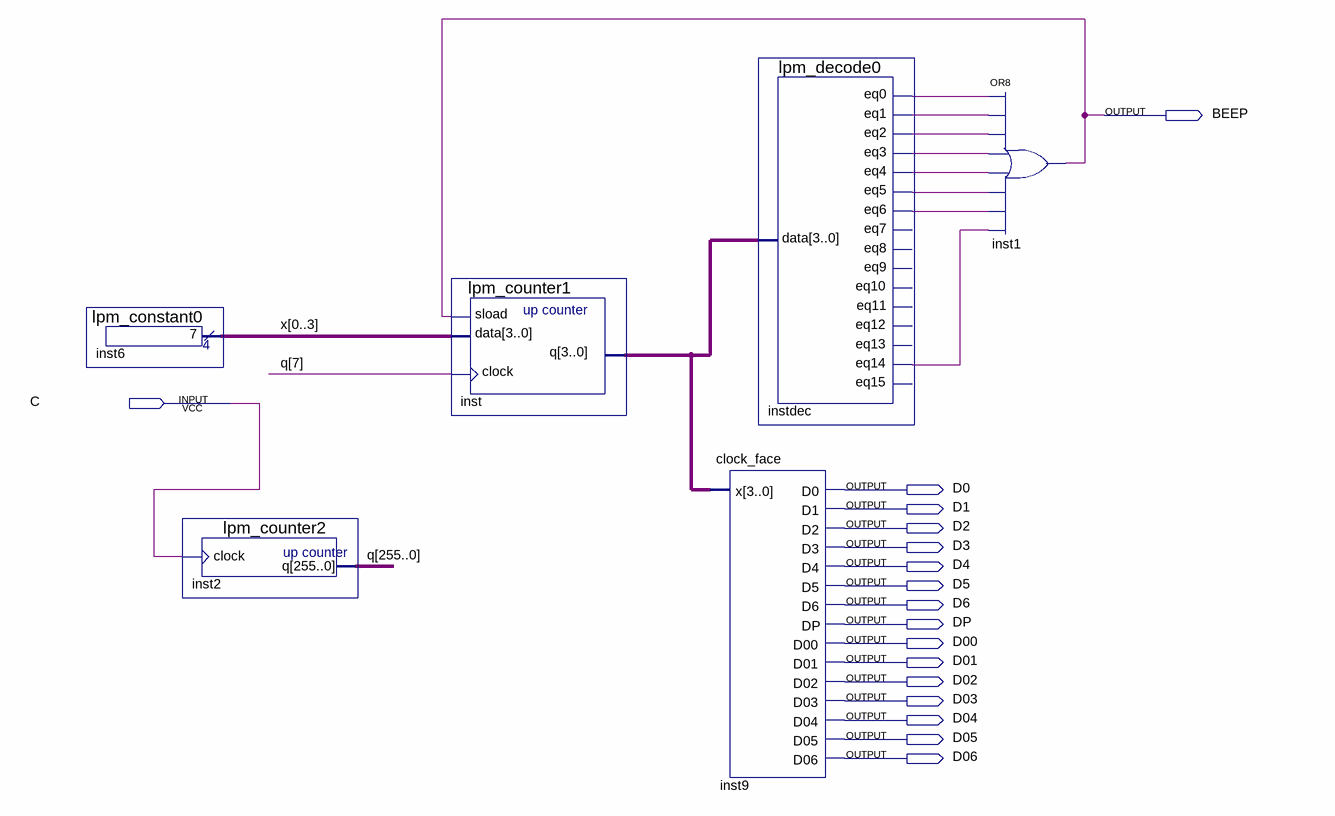
[diagram p0: schematic sheet]
// Quartus schematic 7.bdf as structural Verilog: 6 symbols, 17 pins
module \7  (
  input  C,
  output BEEP,
  output D0,
  output D1,
  output D2,
  output D3,
  output D4,
  output D5,
  output D6,
  output DP,
  output D00,
  output D01,
  output D02,
  output D03,
  output D04,
  output D05,
  output D06
);

  wire instdec_eq0, instdec_eq1, instdec_eq2, instdec_eq3, instdec_eq4, instdec_eq5, instdec_eq6,
       instdec_eq14;
  wire [3:0] inst_q, x;
  wire [255:0] q;

  lpm_constant0 inst6 (.result({x[0], x[1], x[2], x[3]}));
  lpm_counter2 inst2 (.clock(C), .q(q));
  lpm_counter1 inst (.sload(BEEP), .data({x[0], x[1], x[2], x[3]}), .clock(q[7]), .q(inst_q));
  lpm_decode0 instdec (
    .data(inst_q), .eq0(instdec_eq0), .eq1(instdec_eq1), .eq2(instdec_eq2), .eq3(instdec_eq3),
    .eq4(instdec_eq4), .eq5(instdec_eq5), .eq6(instdec_eq6), .eq14(instdec_eq14));  // open: eq7, eq8, eq9, eq10, eq11, eq12, eq13, eq15
  clock_face inst9 (
    .x(inst_q), .D0(D0), .D1(D1), .D2(D2), .D3(D3), .D4(D4), .D5(D5), .D6(D6), .DP(DP), .D00(D00), .D01(D01),
    .D02(D02), .D03(D03), .D04(D04), .D05(D05), .D06(D06));
  or inst1 (BEEP, instdec_eq0, instdec_eq1, instdec_eq2, instdec_eq3, instdec_eq4, instdec_eq5, instdec_eq6, instdec_eq14);
endmodule
